# Altium project AudioBoard.PrjPcb
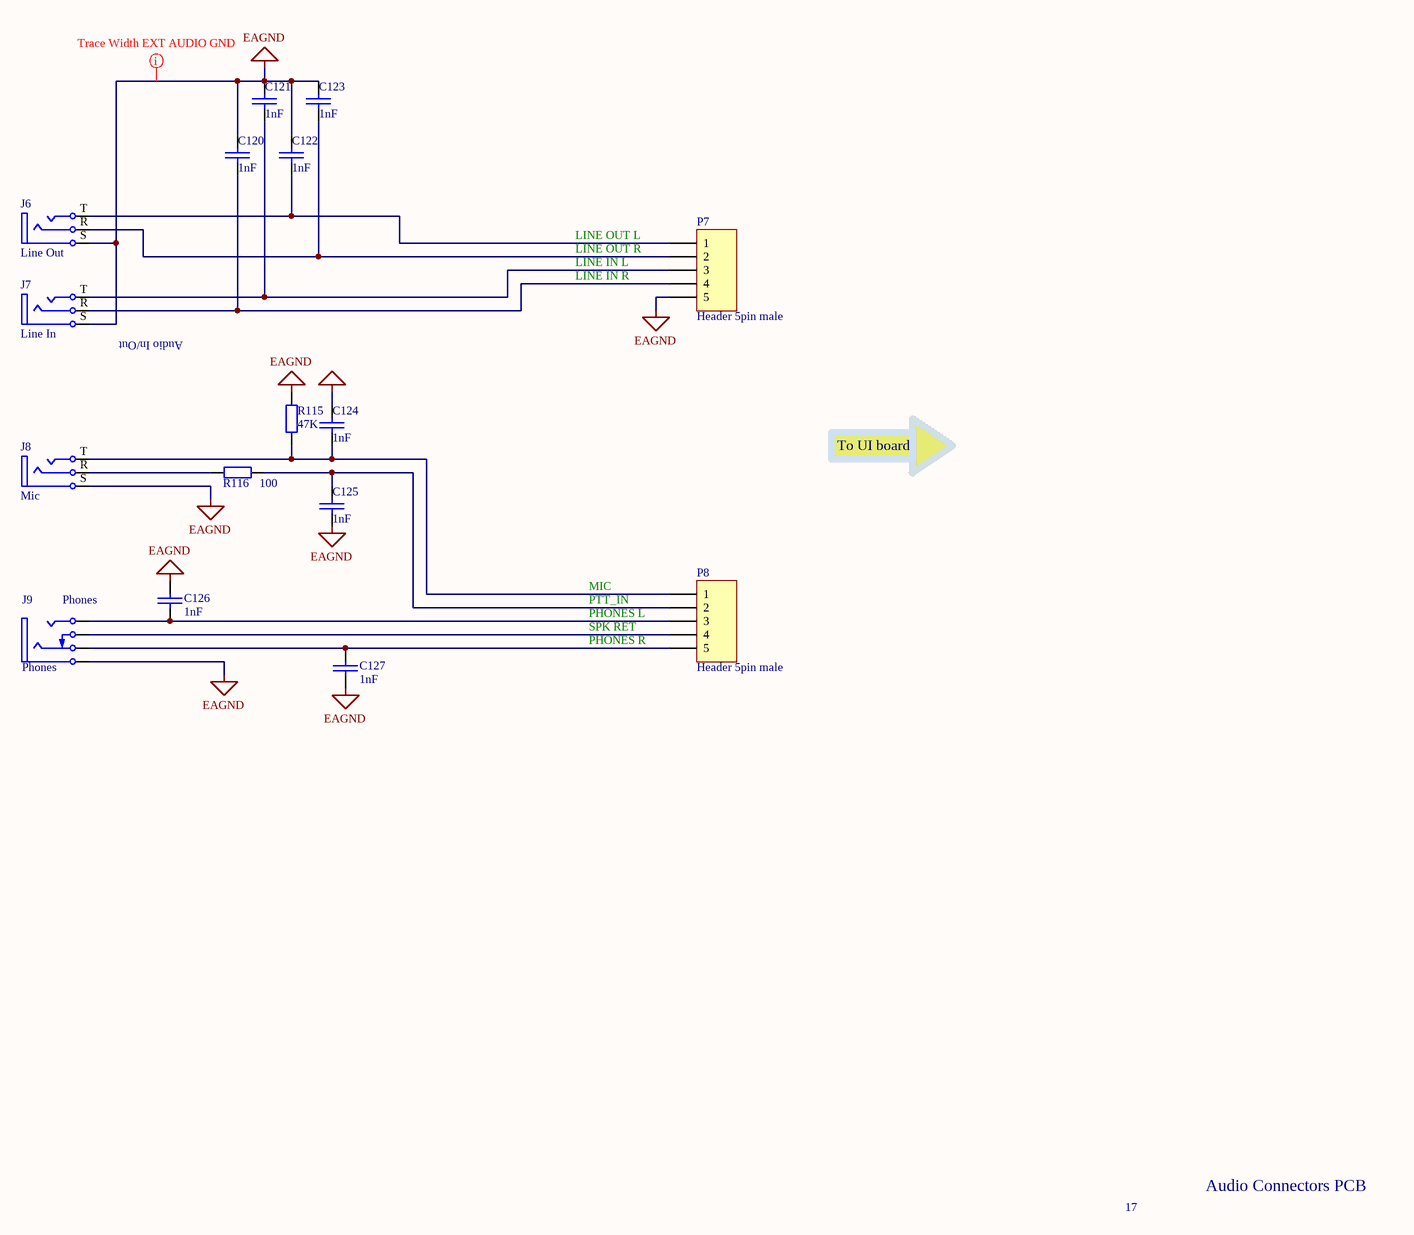
[diagram p0: audio_perif.SchDoc]
1 sheet, 16 parts. Net scope: global (net labels, ports and power ports of the same name join across sheets).

## Sheet audio_perif.SchDoc: mcHF Pro Transceiver UI board
size A3; Author: Krassi Atanassov; CompanyName: MØNKA; Engineer: For radio amateurs experimentation, non-commercial use only. Thank you!; Revision: 0.8.2; SheetTotal: 18

### Parts
C120  1nF  [0805]
C121  1nF  [0805]
C122  1nF  [0805]
C123  1nF  [0805]
C124  1nF  [0805]
C125  1nF  [0805]
C126  1nF  [0805]
C127  1nF  [0805]
J6  Line Out  [MX-387GL_new1]
J7  Line In  [MX-387GL_new1]
J8  Mic  [MX-387GL_new1]
J9  Phones  [KLBR4]
P7  Header 5pin male  [HDR1X5]
P8  Header 5pin male  [HDR1X5]
R115  47K  [0805]
R116  100  [0805]

### Nets
EAGND: C120.1 C121.1 C122.1 C123.1 C124.1 C125.2 C126.2 C127.1 J6.S J7.S J8.S J9.S P7.5 R115.2
NetC120_2: C120.2 J7.R P7.4
NetC121_2: C121.2 J7.T P7.3
NetC122_2: C122.2 J6.T P7.1
NetC123_2: C123.2 J6.R P7.2
NetC124_2: C124.2 J8.T P8.1 R115.1
NetC125_1: C125.1 P8.2 R116.2
NetC126_1: C126.1 J9.T P8.3
NetC127_2: C127.2 J9.R P8.5
NetJ8_R: J8.R R116.1
NetJ9_B: J9.B P8.4

### Layout directives
rule Width Constraint [Pref Width = 30mil    Min Width = 30mil    Max Width = 30mil]: EAGND

### Notes on the sheet
- LINE OUT L
- LINE OUT R
- LINE IN L
- LINE IN R
- (near J7) Audio In/Out
- To UI board
- MIC
- PTT_IN
- PHONES L
- PHONES R
- SPK RET
- 17
- Audio Connectors PCB
- Date:
- File:
- Revision:
- Sheet
- of
- License:

### Library data of the parts
C120-C127 = CAP: Capacitor; Order: FN 185-6408; QT Order: QCC-00259; Price: 0.01
J6-J8 = MX-387GL: Jack Socket,Thru-Hole; Order: FN 126-7376
J9 = PhoneJack: Jack Socket 4 pin; Order: FN 121-7016; Price: 1.28; Function: Phones
P7 P8 = Header 5: Header, 5-Pin
R115 = RES: Resistor; Order: FN 146-9929; QT Order: QCR-00365; Price: 0.021
R116 = RES: Resistor; Order: FN 933-2375; QT Order: QCR-00301; Price: 0.027